# EAGLE design Monoblink (EAGLE 8.6.0)
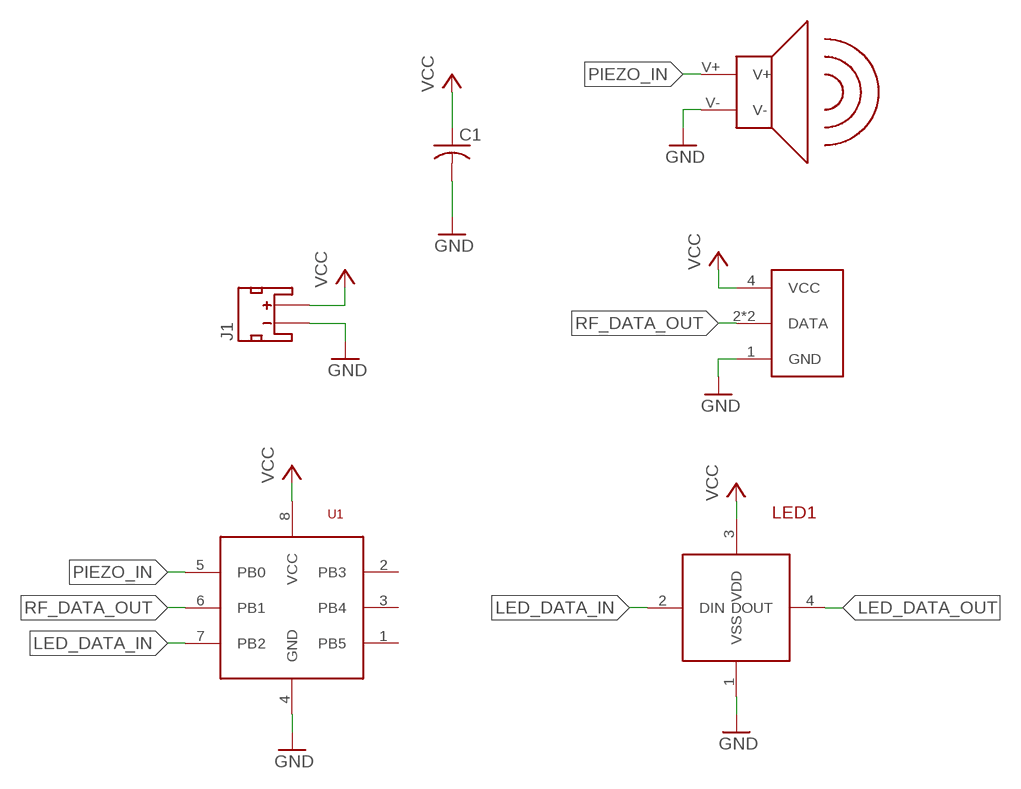
[diagram p0: schematic, sheet 1]

## Parts
C1  C-USC0805  [C0805]
J1  BATT_CONN  [JST-2-SMD]
LED1  NEOPIXEL  [SMD5050]
U1  ATTINY85  [SOIC8]
U$1  RF_CONN  [RF_CONN]
U$2  PIEZO  [PS1240P02BT]

## Nets
GND: C1.2 J1.1(-) LED1.1(VSS) U1.4(GND) U$1.1(GND) U$2.V-
LED_DATA_IN: LED1.2(DIN) U1.7(PB2)
LED_DATA_OUT: LED1.4(DOUT)
PIEZO_IN: U1.5(PB0) U$2.V+
RF_DATA_OUT: U1.6(PB1) U$1.2(DATA) U$1.3(DATA)
VCC: C1.1 J1.2(+) LED1.3(VDD) U1.8(VCC) U$1.4(VCC)
Unconnected: J1.NC1(PAD1) J1.NC2(PAD2) U1.1(PB5) U1.2(PB3) U1.3(PB4)

## Library data of the parts
C1 = Monoblink:C-US: CAPACITOR, American symbol; SPICEPREFIX: C
J1 = Monoblink:BATT_CONN: JST 2MM MALE RA CONNECTOR Two pin, compact surface mount connector. Commonly used as a battery input connection point. We really like the solid locking feeling and high current rating on these small connectors. We use these all the time as battery connectors. Mates to single-cell LiPo batteries. Here is the connector we sell at SparkFun: JST Right Angle Connector - White <https://www.sparkfun.com/products/8612> (PRT-08612) Datasheet <http://www.sparkfun.com/datasheets/Prototyping/Connectors/JST-Horizontal.pdf> It was used on these SparkFun products: SparkFun MOSFET Power Controller <https://www.sparkfun.com/products/11214> (PRT-11214) SparkFun Battery Babysitter - LiPo Battery Manager <https://www.sparkfun.com/products/13777> (PRT-13777) And many, many others that required a lipo battery connection.; PROD_ID: CONN-11443; SF_ID: PRT-08612
LED1 = Monoblink:NEOPIXEL
U1 = Monoblink:ATTINY85
U$1 = Monoblink:RF_CONN
U$2 = Monoblink:PIEZO

## Board
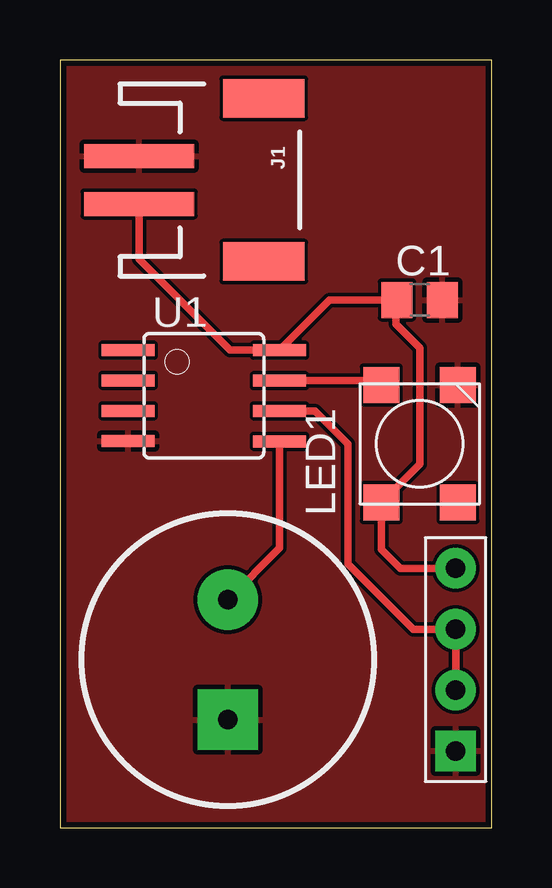
[diagram p1: board, top side]
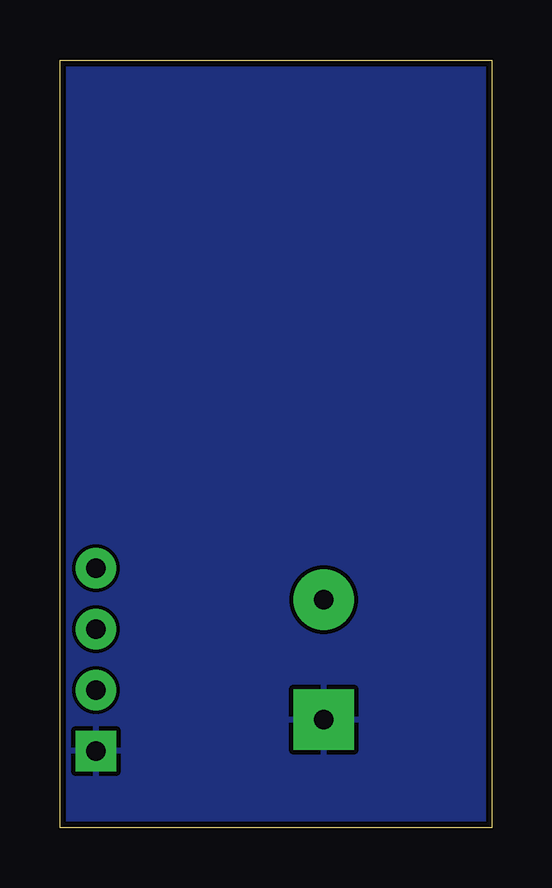
[diagram p2: board, bottom side, seen from below]

Size 18 x 32 mm. Coordinates in mm from the lower left corner, seen from the top.
Outline: 0,0 18,0 18,32 0,32 0,0
Copper layers 16: Bottom 0.035mm
Design rules "eC_1Layer_PClass6_BaseCopperO35_eCDefault": minimum track width 0.15mm, minimum drill 0.35mm, track to track 0.15mm, track to pad 0.15mm, pad to pad 0.15mm, via to via 0.15mm, smd to smd 0mil, copper to edge 0.25mm, drill to drill 0.35mm, minimum pad ring 0.3mm, minimum via ring 0.3mm, stop-mask expansion 0mil, vias tented up to drill 0.45mm, thermal gap 0.2mm

### Footprints (pad centres in the part's own frame; a part is rotated, then mirrored left to right if it is on the bottom)
C0805 = smd 1.3 x 1.5: 1 -0.95,0; 2 0.95,0
JST-2-SMD = smd 1 x 4.6: 1 -1,-3.7; 2 1,-3.7 | smd 1.6 x 3.4: NC1 -3.4,1.5; NC2 3.4,1.5
SMD5050 = smd 1.5 x 1.5: 1 2.45,-1.6; 2 2.45,1.6; 3 -2.45,1.6; 4 -2.45,-1.6
SOIC8 = smd 0.5 x 2.2: 1 -1.905,-3.154; 2 -0.645,-3.154; 3 0.625,-3.154; 4 1.895,-3.154; 5 1.905,3.154; 6 0.635,3.154; 7 -0.635,3.154; 8 -1.905,3.154
RF_CONN = drill 0.8 pad 1.676 square: 1 0,-3.81 | drill 0.8 pad 1.676: 2 0,-1.27; 3 0,1.27; 4 0,3.81
PS1240P02BT = drill 0.8 pad 2.54: V+ 0,2.5 | drill 0.8 pad 2.54 square: V- 0,-2.5

### Placement (x,y rotation side)
C1  15,22 0 top
J1  7,27 270 top
LED1  15,16 90 top
U1  6,18 270 top
U$1  16.5,7 0 top
U$2  7,7 0 top

### Tracks (layer width: path | path; a pad name or v marks a point on that pad's centre or on a via)
GND
  pour Top (rank 3): 0,32 18,32 18,0 0,0
  pour Bottom (rank 2): 0,32 18,32 18,0 0,0
LED_DATA_IN
  Top 0.305: U1.7 13.21,18.64 LED1.2
PIEZO_IN
  Top 0.305: U$2.V+ 9.15,11.65 U1.5
RF_DATA_OUT
  Top 0.305: U$1.2 U$1.3 14.73,8.27 12,11 12,16 10.63,17.36 U1.6
VCC
  Top 0.305: U$1.4 14.19,10.81 13.4,11.6 LED1.3 15,15.15 15,20 14,21 14,21.95 C1.1 11.25,22 U1.8 7.09,19.91 3.3,23.7 J1.2